# EAGLE design CP2102-ESP01-adaptor (EAGLE 9.6.2)
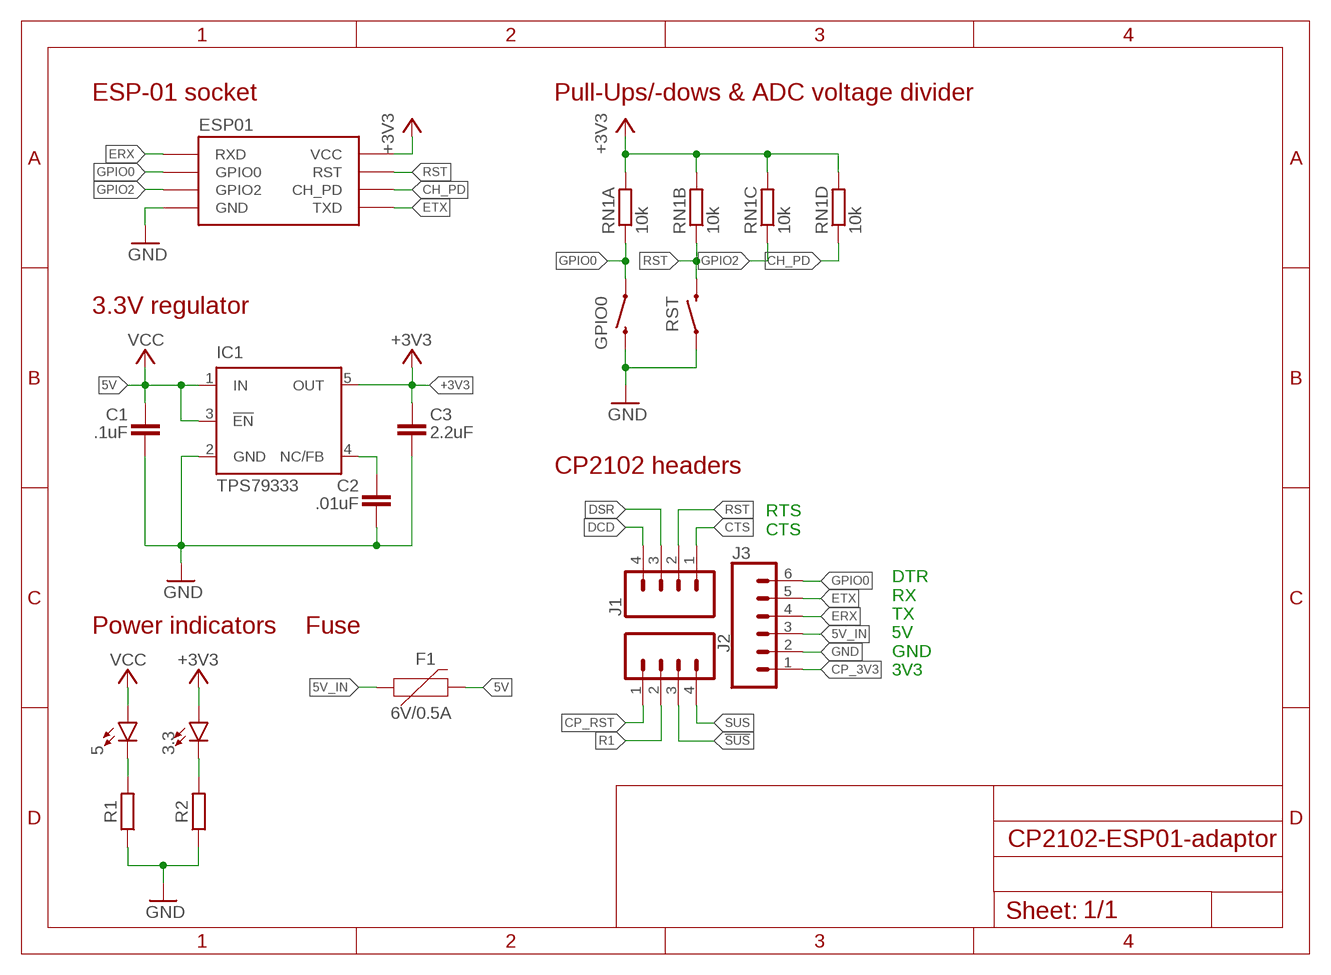
[diagram p0: schematic, sheet 1]

## Parts
3.3  LED0603  [LED-0603]
5  LED0603  [LED-0603]
C1  .1uF  CAPACITOR_NPOL-0603  [C603]
C2  .01uF  CAPACITOR_NPOL-0603  [C603]
C3  2.2uF  CAPACITOR_NPOL-0603  [C603]
ESP-01  ESP01  [ESP01]
F1  6V/0.5A  PPTC_HALF-AMP  [1206]
GPIO0  MOMENTARY-SWITCH-SPST-SMD-RIGHT-ANGLE  [TACTILE_SWITCH_SMD_RIGHT_ANGLE]
IC1  TPS79333  TPS77033  [SOT23-DBV]
J1  CONN_04LOCK  [1X04_LOCK]
J2  CONN_04LOCK  [1X04_LOCK]
J3  CONN_06LOCK  [1X06_LOCK]
R1  1k  RESISTOR-0603  [R603]
R2  1k  RESISTOR-0603  [R603]
RN1  10k  RESISTOR_ARRAY_4  [RN8P-4R-CRA06S]
RST  MOMENTARY-SWITCH-SPST-SMD-RIGHT-ANGLE  [TACTILE_SWITCH_SMD_RIGHT_ANGLE]

## Nets
5V: 5.A C1.1 F1.2 IC1.1(IN) IC1.3(!EN) ; supply symbol labelled VCC
5V_IN: F1.1 J3.3
!SUS: J2.3
+3V3: 3.3.A C3.1 ESP-01.VCC IC1.5(OUT) RN1.5 RN1.6 RN1.7 RN1.8
BYPASS: C2.1 IC1.4(NC/FB)
CH_PD: ESP-01.CH_PD RN1.4
CP_3V3: J3.1
CP_RST: J2.1
CTS: J1.1
DCD: J1.4
DSR: J1.3
ERX: ESP-01.RX(RXD) J3.4
ETX: ESP-01.TX(TXD) J3.5
GND: C1.2 C2.2 C3.2 ESP-01.GND GPIO0.2 IC1.2(GND) J3.2 R1.1 R2.1 RST.1
GPIO0: ESP-01.GPIO0 GPIO0.1 J3.6 RN1.1
GPIO2: ESP-01.GPIO2 RN1.3
N$1: 5.C R1.2
N$3: 3.3.C R2.2
R1: J2.2
RST: ESP-01.RST J1.2 RN1.2 RST.2
SUS: J2.4

## Notes on the sheet
- ESP-01 socket | Pull-Ups/-dows & ADC voltage divider
- 3.3V regulator
- CP2102 headers
- RTS
  CTS
- DTR
  RX
  TX
  5V
  GND
  3V3
- Power indicators | Fuse

## Library data of the parts
3.3 5 = SparkFun-LED:LED: LED (Generic) Standard schematic elements and footprints for 5mm, 3mm, 1206, and 0603 sized LEDs. Generic LEDs with no color specified.
C1-C3 = dp_devices:CAPACITOR_NPOL: Non-Polarized capacitor in various packages
ESP-01 = esp8266modules:ESP01: ESP8266 Wifi module 01
F1 = SparkFun-Fuses:PPTC: Resettable Fuse PPTC Resettable Fuse. Really a sort of resistor with a polymeric positive temperature coefficient whose resistance increases dramatically with an increase in temperature. When heated by the power passing through the resistance rises causing the current to be limited, protecting the circuit. This is achieved by the transition of the polymer from a crystalline to an amorphous state where the conductive carbon separates breaking the conductive pathways found in the cool crystalline structure. When a PPTC cools back down it resumes conducting letting the circuit turn back on. SparkFun Products: SparkFun RedBoard - Programmed with Arduino <https://www.sparkfun.com/products/12757> Pro Micro - 5V/16MHz <https://www.sparkfun.com/products/12640> Arduino Pro 328 - 5V/16MHz <https://www.sparkfun.com/products/10915> MP3 Trigger <https://www.sparkfun.com/products/13720>; PROD_ID: RES-08585
GPIO0 RST = SparkFun-Switches:MOMENTARY-SWITCH-SPST: Momentary Switch (Pushbutton) - SPST Normally-open (NO) SPST momentary switches (buttons, pushbuttons). Variants PTH-12MM - 12mm square, through-hole Momentary Pushbutton Switch - 12mm Square <https://www.sparkfun.com/products/9190> (COM-09190) PTH-6.0MM, PTH-6.0MM-KIT - 6.0mm square, through-hole Mini Pushbutton Switch <https://www.sparkfun.com/products/97> (COM-00097) KIT package intended for soldering kit's - only one side of pads' copper is exposed. PTH-RIGHT-ANGLE-KIT - Right-angle, through-hole Right Angle Tactile Button <https://www.sparkfun.com/products/10791> - Used on SparkFun BigTime Watch Kit <https://www.sparkfun.com/products/11734> SMD-12MM - 12mm square, surface-mount Tactile Button - SMD (12mm) <https://www.sparkfun.com/products/12993> (COM-12993) Used on SparkFun PicoBoard <https://www.sparkfun.com/products/11888> SMD-4.5MM - 4.5mm Square Trackball Switch Used on SparkFun Blackberry Trackballer Breakout <https://www.sparkfun.com/products/13169> SMD-4.6MMX2.8MM - 4.60mm x 2.80mm, surface mount Used on SparkFun SAMD21 Mini Breakout <https://www.sparkfun.com/products/13664> SMD-5.2MM, SMD-5.2-REDUNDANT - 5.2mm square, surface-mount Mini Pushbutton Switch - SMD <https://www.sparkfun.com/products/8720> (COM-08720) Used on Arduino Pro Mini <https://www.sparkfun.com/products/11114> REDUNDANT package connects both switch circuits together SMD-6.0X3.5MM - 6.0 x 3.5mm, surface mount Momentary Reset Switch SMD <https://www.sparkfun.com/products/8229> (COM-08229) SMD-6.2MM-TALL - 6.2mm square, surface mount Tactile Button - SMD (6mm) <https://www.sparkfun.com/products/12992> Used on SparkFun Digital Sandbox <https://www.sparkfun.com/products/12651> SMD-RIGHT-ANGLE - Right-angle, surface mount Used on SparkFun Block for Intel® Edison - Arduino <https://www.sparkfun.com/products/13036>; PROD_ID: COMP-12265
IC1 = texas:TPS770*: ULTRALOW-POWER 50-mA LOW-DROPOUT LINEAR REGULATORS 50-mA Low-Dropout Regulator Source: http://focus.ti.com/lit/ds/symlink/tps77001.pdf; MF: TEXAS INSTRUMENTS; MPN: TPS77033DBVT; OC_FARNELL: 8461570; OC_NEWARK: 77C1187
J1 J2 = SparkFun-Connectors:CONN_04: Multi connection point. Often used as Generic Header-pin footprint for 0.1 inch spaced/style header connections On any of the 0.1 inch spaced packages, you can populate with these: Break Away Headers - Straight <https://www.sparkfun.com/products/116> (PRT-00116) Break Away Male Headers - Right Angle <https://www.sparkfun.com/products/553> (PRT-00553) Female Headers <https://www.sparkfun.com/products/115> (PRT-00115) Break Away Headers - Machine Pin <https://www.sparkfun.com/products/117> (PRT-00117) Break Away Female Headers - Swiss Machine Pin <https://www.sparkfun.com/products/743> (PRT-00743) For SCREWTERMINALS and SPRING TERMINALS visit here: Screw Terimnals on SparkFun.com <https://www.sparkfun.com/search/results?term=Screw+Terminals> (5mm/3.5mm/2.54mm spacing) This device is also useful as a general connection point to wire up your design to another part of your project. Our various solder wires solder well into these plated through hole pads. Hook-Up Wire - Assortment (Stranded, 22 AWG) <https://www.sparkfun.com/products/11375> (PRT-11375) Hook-Up Wire - Assortment (Solid Core, 22 AWG) <https://www.sparkfun.com/products/11367> (PRT-11367) View the entire wire category on our website here <https://www.sparkfun.com/categories/141> Special notes: Molex polarized connector foot print use with SKU : PRT-08231 with associated crimp pins and housings. 1MM SMD Version SKU: PRT-10208; PROD_ID: CONN-09696
J3 = SparkFun-Connectors:CONN_06: Multi connection point. Often used as Generic Header-pin footprint for 0.1 inch spaced/style header connections On any of the 0.1 inch spaced packages, you can populate with these: Break Away Headers - Straight <https://www.sparkfun.com/products/116> (PRT-00116) Break Away Male Headers - Right Angle <https://www.sparkfun.com/products/553> (PRT-00553) Female Headers <https://www.sparkfun.com/products/115> (PRT-00115) Break Away Headers - Machine Pin <https://www.sparkfun.com/products/117> (PRT-00117) Break Away Female Headers - Swiss Machine Pin <https://www.sparkfun.com/products/743> (PRT-00743) Arduino Stackable Header - 6 Pin <https://www.sparkfun.com/products/9280> (PRT-09280) For SCREWTERMINALS and SPRING TERMINALS visit here: Screw Terimnals on SparkFun.com <https://www.sparkfun.com/search/results?term=Screw+Terminals> (5mm/3.5mm/2.54mm spacing) This device is also useful as a general connection point to wire up your design to another part of your project. Our various solder wires solder well into these plated through hole pads. Hook-Up Wire - Assortment (Stranded, 22 AWG) <https://www.sparkfun.com/products/11375> (PRT-11375) Hook-Up Wire - Assortment (Solid Core, 22 AWG) <https://www.sparkfun.com/products/11367> (PRT-11367) View the entire wire category on our website here <https://www.sparkfun.com/categories/141>
R1 R2 = dp_devices:RESISTOR
RN1 = dp_devices:RESISTOR_ARRAY_4: 4 Resistor Array 0603

## Board
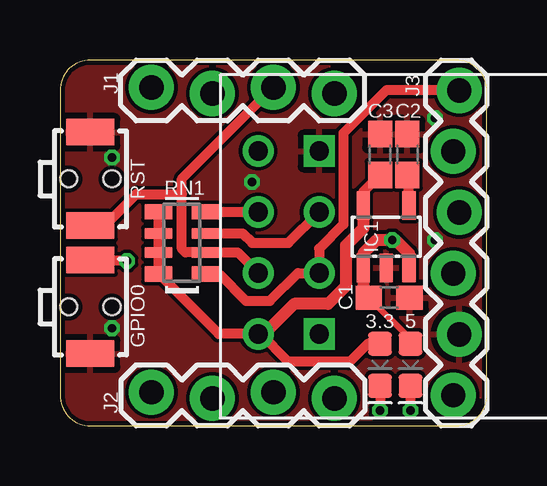
[diagram p1: board, top side]
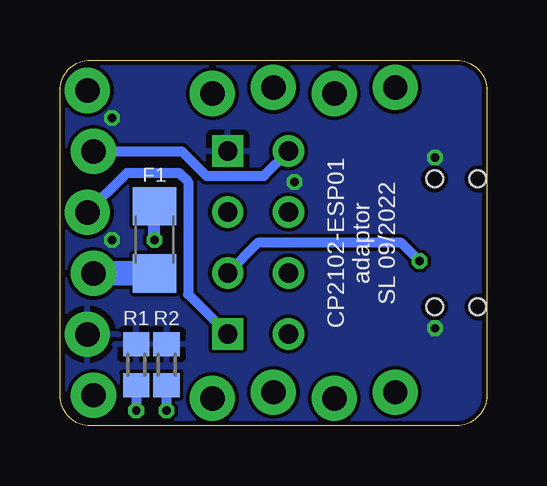
[diagram p2: board, bottom side, seen from below]

Size 17.78 x 15.24 mm. Coordinates in mm from the lower left corner, seen from the top.
Outline: 0,13.97 0,1.27 arc90 1.27,0 16.51,0 arc90 17.78,1.27 17.78,13.97 arc90 16.51,15.24 1.27,15.24 arc90 0,13.97
Copper layers (1*16): Top 0.035mm / dielectric 1.5mm / Bottom 0.035mm
Design rules "aisler_2_layer": minimum track width 0.1mm, minimum drill 0.2mm, track to track 0.15mm, track to pad 0.15mm, pad to pad 0.1mm, via to via 0.1mm, smd to smd 0.1mm, copper to edge 0.2mm, drill to drill 0.21mm, minimum pad ring 0.25mm, minimum via ring 0.15mm, stop-mask expansion 0mil, vias tented up to drill 0mil, thermal gap 10mil

### Footprints (pad centres in the part's own frame; a part is rotated, then mirrored left to right if it is on the bottom)
LED-0603 = smd 1 x 1: A -0.877,0; C 0.877,0
C603 = smd 1.1 x 1: 1 -0.85,0; 2 0.85,0
ESP01 = drill 0.8: CH_PD -1.285,-8.178; GPIO0 1.255,-5.638; GPIO2 -1.285,-5.638; RST 1.255,-8.178; TX -3.825,-8.178; VCC 3.795,-8.178 | drill 0.8 square: GND -3.825,-5.638; RX 3.795,-5.638
1206 = smd 1.6 x 1.8: 1 -1.4,0; 2 1.4,0
TACTILE_SWITCH_SMD_RIGHT_ANGLE = smd 1.1 x 2: 1 -1.95,0; 2 1.95,0 | hole 0.7: 0,0.9; 0,-0.9
SOT23-DBV = smd 0.55 x 1.2: 1 -0.95,-1.3; 2 0,-1.3; 3 0.95,-1.3; 4 0.95,1.3; 5 -0.95,1.3
1X04_LOCK = drill 1.016 pad 1.88: 1 0,0.127; 2 2.54,-0.127; 3 5.08,0.127; 4 7.62,-0.127
1X06_LOCK = drill 1.016 pad 1.88: 1 0,0; 2 2.54,-0.254; 3 5.08,0; 4 7.62,-0.254; 5 10.16,0; 6 12.7,-0.254
R603 = smd 1 x 1.1: 1 -0.85,0; 2 0.85,0
RN8P-4R-CRA06S = smd 0.63 x 1.15: 1 -1.295,-0.975; 4 1.295,-0.975; 5 1.295,0.975; 8 -1.295,0.975 | smd 0.44 x 1.15: 2 -0.4,-0.975; 3 0.4,-0.975; 6 0.4,0.975; 7 -0.4,0.975

### Placement (x,y rotation side)
3.3  13.34,2.54 270 top
5  14.61,2.54 270 top
C1  13.72,5.33 0 top
C2  14.48,11.3 90 top
C3  13.34,11.3 90 top
ESP-01  16.43,7.62 270 top
F1  13.84,7.75 90 bottom
GPIO0  1.27,4.95 270 top
IC1  13.59,7.87 0 top
J1  11.43,13.97 180 top
J2  3.81,1.27 0 top
J3  16.38,1.27 90 top
R1  14.61,2.54 270 bottom
R2  13.34,2.54 270 bottom
RN1  5.08,7.62 90 top
RST  1.27,10.29 270 top

### Tracks (layer width: path | path; a pad name or v marks a point on that pad's centre or on a via)
5V  (via drill 0.35)
  Top 0.254: C1.1 14.61,3.6 5.A
  Top 0.508: IC1.3 14.54,7.18 13.97,7.75 v13.84,7.75 13.21,7.75 12.64,7.18 IC1.1 12.64,5.56 C1.1
  Bottom 0.508: v13.84,7.75 F1.2
5V_IN
  Bottom 1.016: F1.1 J3.3
+3V3
  Top 0.406: RN1.5 RN1.6 RN1.7 RN1.8 6.61,3.83 ESP-01.VCC 8.36,3.83 9.52,2.67 12.06,2.67 12.81,3.42 3.3.A | C3.1 12.64,9.76 IC1.5
  Top 0.508: IC1.5 12.64,8.24 11.91,7.51 11.91,5.82 11.18,5.08 9.77,5.08 8.51,3.83 ESP-01.VCC
BYPASS
  Top 0.406: IC1.4 14.54,10.39 C2.1
CH_PD
  Top 0.406: RN1.4 8.25,8.91 ESP-01.CH_PD
ERX
  Bottom 0.406: J3.4 14.99,10.54 12.83,10.54 12.45,10.16 12.45,5.47 ESP-01.RX
ETX
  Bottom 0.406: J3.5 12.7,11.43 11.68,10.41 9.29,10.41 ESP-01.TX
GND  (via drill 0.35)
  other vias: 8,10.16 2.16,11.18 2.16,4.06 15.62,12.83 15.62,7.75
  pour Top: 0,15.24 17.78,15.24 17.78,0 0,0
  pour Bottom: 0,15.24 17.78,15.24 17.78,0 0,0
GPIO0  (via drill 0.35)
  Top 0.406: RN1.1 6.63,6.33 7.75,5.21 8.75,5.21 9.91,6.37 ESP-01.GPIO0 10.8,7.38 11.81,8.4 11.81,12.19 13.59,13.97 J3.6 | GPIO0.1 2.75,6.9 v2.79,6.86
  Bottom 0.406: v2.79,6.86 3.56,7.62 9.54,7.62 ESP-01.GPIO0
GPIO2
  Top 0.406: RN1.3 7.6,8.02 8,7.62 9.51,7.62 ESP-01.GPIO2
N$1  (via drill 0.35)
  Top 0.406: v14.61,0.64 5.C
  Bottom 0.406: R1.2 v14.61,0.64
N$3  (via drill 0.35)
  Top 0.406: 3.3.C v13.34,0.64
  Bottom 0.406: v13.34,0.64 R2.2
RST
  Top 0.406: ESP-01.RST 7.4,7.22 RN1.2 5.23,7.22 5.08,7.37 5.08,9.65 | J1.2 5.08,10.29 5.08,9.65 | RST.2 1.86,8.34 3.17,9.65 5.08,9.65

### Text on the board
bNames: CP2102-ESP01 / adaptor / SL 09/2022